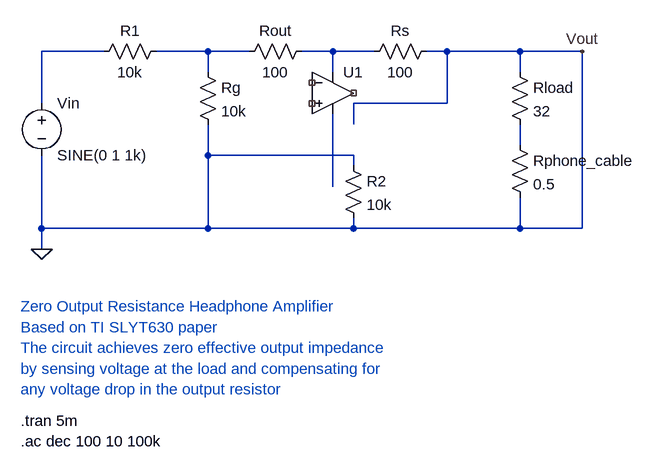
[diagram p0: schematic zero_db_headphone_amp.asc]
zero_db_headphone_amp.asc, the LTspice schematic file:
Version 4
SHEET 1 1200 800
WIRE 176 128 80 128
WIRE 336 128 256 128
WIRE 400 128 336 128
WIRE 528 128 480 128
WIRE 592 128 528 128
WIRE 704 128 672 128
WIRE 816 128 704 128
WIRE 912 128 816 128
WIRE 336 160 336 128
WIRE 528 160 528 128
WIRE 816 160 816 128
WIRE 80 208 80 128
WIRE 704 208 704 128
WIRE 704 208 560 208
WIRE 560 240 560 208
WIRE 816 272 816 240
WIRE 336 288 336 240
WIRE 560 288 336 288
WIRE 560 304 560 288
WIRE 528 336 528 224
WIRE 80 400 80 288
WIRE 336 400 336 288
WIRE 336 400 80 400
WIRE 528 400 336 400
WIRE 560 400 560 384
WIRE 560 400 528 400
WIRE 816 400 816 352
WIRE 816 400 560 400
WIRE 912 400 912 128
WIRE 912 400 816 400
WIRE 80 432 80 400
FLAG 80 432 0
FLAG 912 128 Vout
SYMBOL voltage 80 192 R0
WINDOW 123 0 0 Left 0
WINDOW 39 0 0 Left 0
SYMATTR InstName Vin
SYMATTR Value SINE(0 1 1k)
SYMBOL res 160 144 R270
WINDOW 0 32 56 VTop 2
WINDOW 3 0 56 VBottom 2
SYMATTR InstName R1
SYMATTR Value 10k
SYMBOL res 384 144 R270
WINDOW 0 32 56 VTop 2
WINDOW 3 0 56 VBottom 2
SYMATTR InstName Rout
SYMATTR Value 100
SYMBOL res 576 144 R270
WINDOW 0 32 56 VTop 2
WINDOW 3 0 56 VBottom 2
SYMATTR InstName Rs
SYMATTR Value 100
SYMBOL res 320 144 R0
SYMATTR InstName Rg
SYMATTR Value 10k
SYMBOL Opamps/UniversalOpAmp2 528 192 R0
SYMATTR InstName U1
SYMATTR Value2 Avol=100k GBW=10Meg Slew=5Meg
SYMBOL res 800 144 R0
SYMATTR InstName Rload
SYMATTR Value 32
SYMBOL res 800 256 R0
SYMATTR InstName Rphone_cable
SYMATTR Value 0.5
SYMBOL res 544 288 R0
SYMATTR InstName R2
SYMATTR Value 10k
TEXT 48 520 Left 2 ;Zero Output Resistance Headphone Amplifier
TEXT 48 552 Left 2 ;Based on TI SLYT630 paper
TEXT 48 584 Left 2 ;The circuit achieves zero effective output impedance
TEXT 48 616 Left 2 ;by sensing voltage at the load and compensating for
TEXT 48 648 Left 2 ;any voltage drop in the output resistor
TEXT 48 696 Left 2 !.tran 5m
TEXT 48 728 Left 2 !.ac dec 100 10 100k

The netlist it stands for:
* zero_db_headphone_amp.asc
Vin N001 0 SINE(0 1 1k)
R1 N001 N002 10k
Rout N002 N003 100
Rs N003 0 100
Rg N002 0 10k
XU1 NC_01 NC_02 N003 N005 NC_03 level2 Avol=100k GBW=10Meg Slew=5Meg Ilimit=25m Rail=0 Vos=0 En=0 Enk=0 In=0 Ink=0 Rin=500Meg  ; pins In+ In- V+ V- OUT
Rload 0 N004 32
Rphone_cable N004 0 0.5
R2 0 0 10k
* Zero Output Resistance Headphone Amplifier
* Based on TI SLYT630 paper
* The circuit achieves zero effective output impedance
* by sensing voltage at the load and compensating for
* any voltage drop in the output resistor
.tran 5m
.ac dec 100 10 100k
.lib UniversalOpAmp2.lib
.backanno
.end